# EAGLE schematic controller (EAGLE 9.2.2)

## Sheet 1 of 2
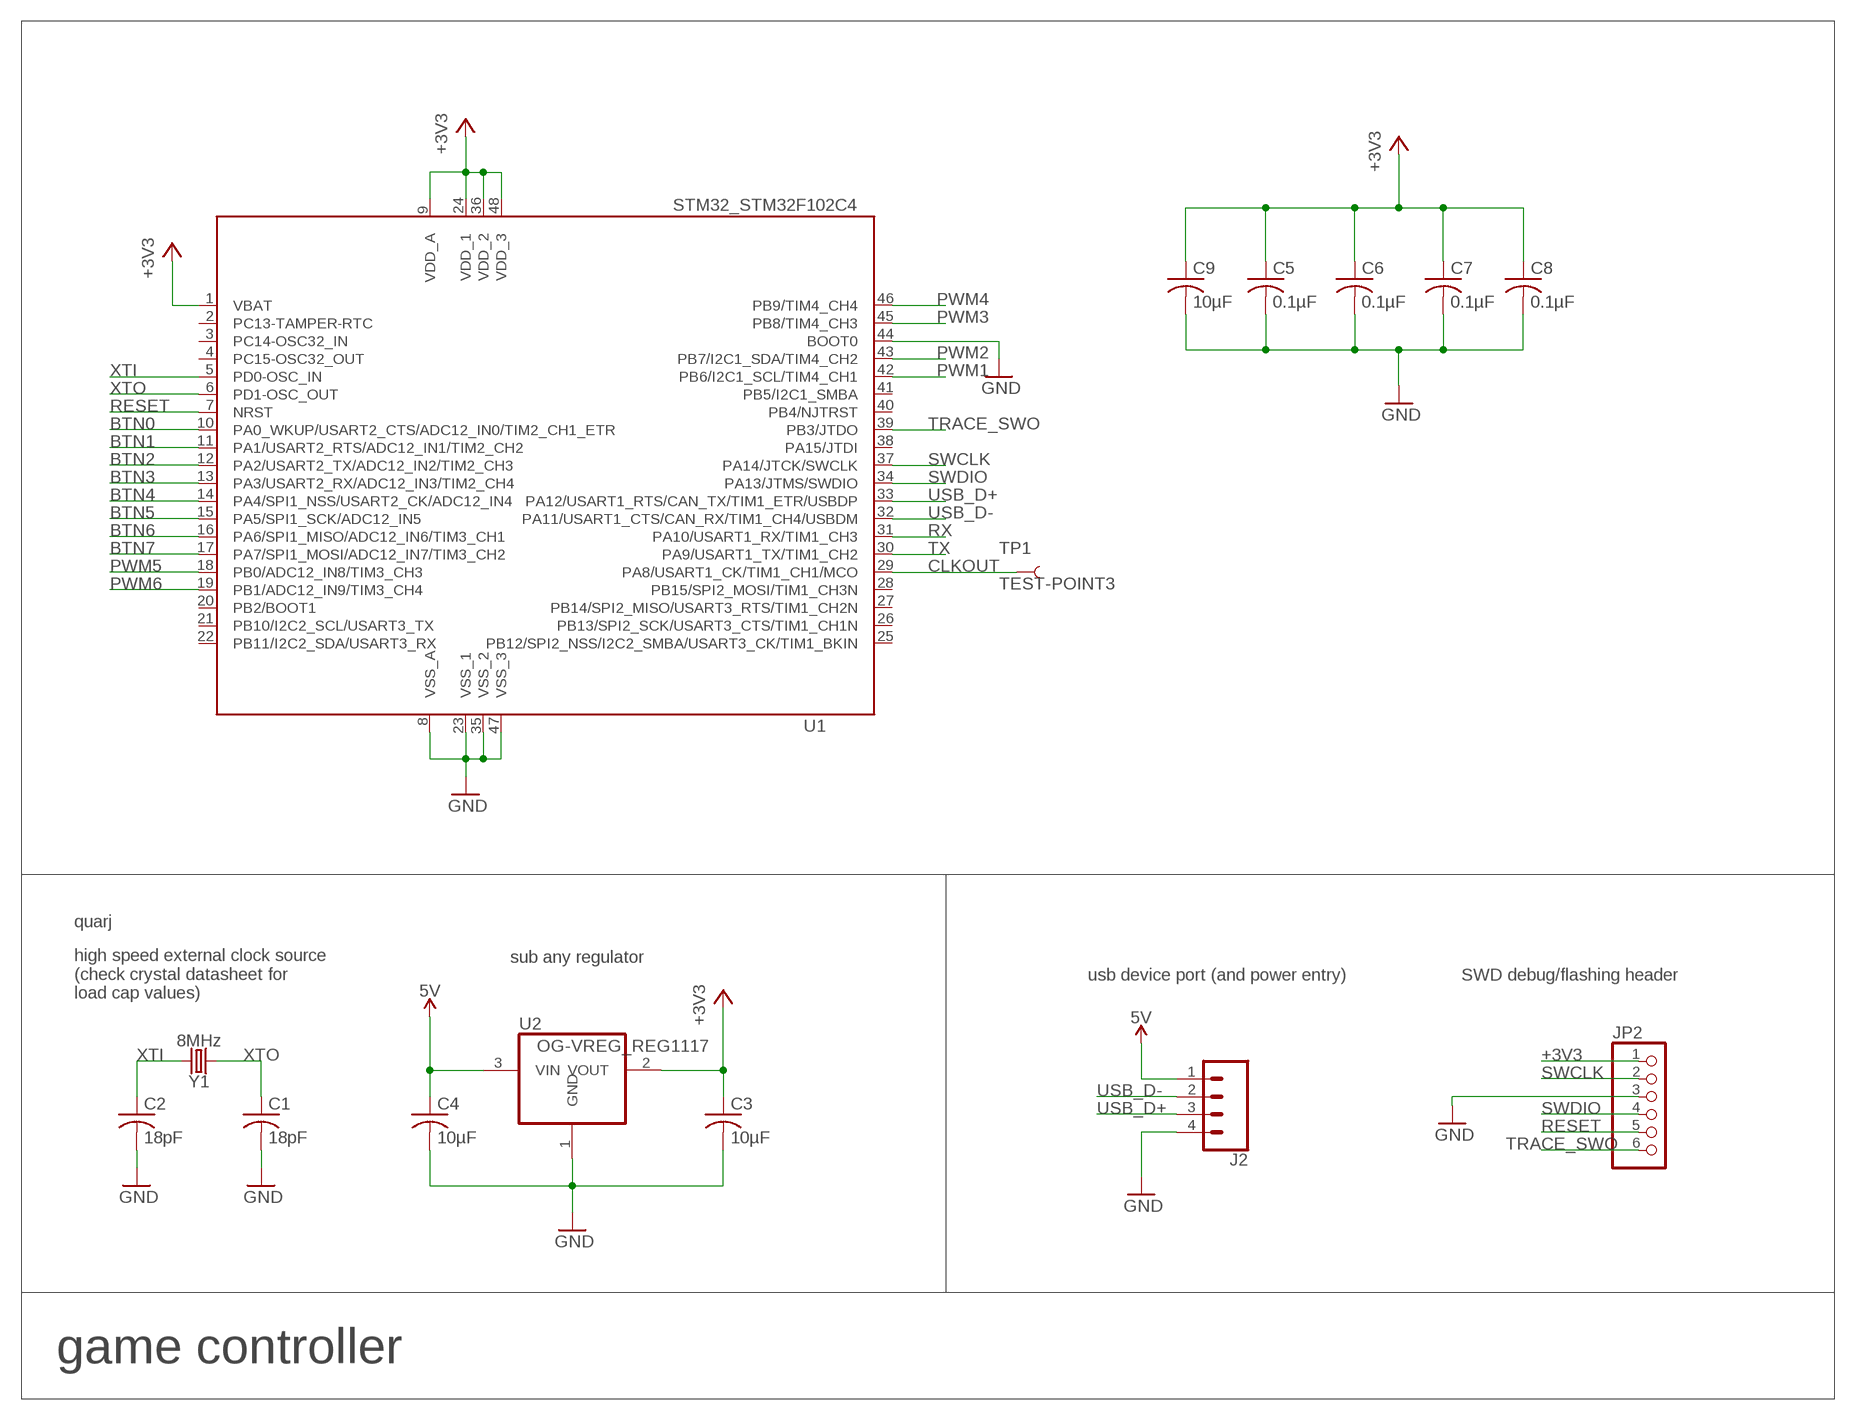
[diagram p0: schematic, sheet 1]

### Parts
C1  18pF  RCL_C-USC0805K  [RCL_C0805K]
C2  18pF  RCL_C-USC0805K  [RCL_C0805K]
C3  10µF  RCL_C-USC0805K  [RCL_C0805K]
C4  10µF  RCL_C-USC0805K  [RCL_C0805K]
C5  0.1µF  RCL_C-USC0805K  [RCL_C0805K]
C6  0.1µF  RCL_C-USC0805K  [RCL_C0805K]
C7  0.1µF  RCL_C-USC0805K  [RCL_C0805K]
C8  0.1µF  RCL_C-USC0805K  [RCL_C0805K]
C9  10µF  RCL_C-USC0805K  [RCL_C0805K]
J2  CONN_04  [1X04]
JP2  PINHD-1X6  [1X06]
TP1  TEST-POINT3  [PAD.03X.03]
U1  STM32_STM32F102C4  [STM32_LQFP48]
U2  OG-VREG_REG1117  [OG-VREG_SOT223]
Y1  8MHz  CRYSTAL-8MHZSMD-HC49UP  [HC49UP]

### Nets
5V: C4.1 J2.1 U2.3(VIN)
+3V3: C3.1 C5.1 C6.1 C7.1 C8.1 C9.1 JP2.1 U1.1(VBAT) U1.9(VDD_A) U1.24(VDD_1) U1.36(VDD_2) U1.48(VDD_3) U2.2(VOUT) ; also sheet 2
BTN0: U1.10(PA0_WKUP/USART2_CTS/ADC12_IN0/TIM2_CH1_ETR)
BTN1: U1.11(PA1/USART2_RTS/ADC12_IN1/TIM2_CH2) ; also sheet 2
BTN2: U1.12(PA2/USART2_TX/ADC12_IN2/TIM2_CH3) ; also sheet 2
BTN3: U1.13(PA3/USART2_RX/ADC12_IN3/TIM2_CH4)
BTN4: U1.14(PA4/SPI1_NSS/USART2_CK/ADC12_IN4)
BTN5: U1.15(PA5/SPI1_SCK/ADC12_IN5)
BTN6: U1.16(PA6/SPI1_MISO/ADC12_IN6/TIM3_CH1)
BTN7: U1.17(PA7/SPI1_MOSI/ADC12_IN7/TIM3_CH2)
CLKOUT: TP1.P$1 U1.29(PA8/USART1_CK/TIM1_CH1/MCO)
GND: C1.2 C2.2 C3.2 C4.2 C5.2 C6.2 C7.2 C8.2 C9.2 J2.4 JP2.3 U1.8(VSS_A) U1.23(VSS_1) U1.35(VSS_2) U1.44(BOOT0) U1.47(VSS_3) U2.1(GND) ; also sheet 2
PWM1: U1.42(PB6/I2C1_SCL/TIM4_CH1) ; also sheet 2
PWM2: U1.43(PB7/I2C1_SDA/TIM4_CH2) ; also sheet 2
PWM3: U1.45(PB8/TIM4_CH3) ; also sheet 2
PWM4: U1.46(PB9/TIM4_CH4) ; also sheet 2
PWM5: U1.18(PB0/ADC12_IN8/TIM3_CH3) ; also sheet 2
PWM6: U1.19(PB1/ADC12_IN9/TIM3_CH4) ; also sheet 2
RESET: JP2.5 U1.7(NRST)
RX: U1.31(PA10/USART1_RX/TIM1_CH3)
SWCLK: JP2.2 U1.37(PA14/JTCK/SWCLK)
SWDIO: JP2.4 U1.34(PA13/JTMS/SWDIO)
TRACE_SWO: JP2.6 U1.39(PB3/JTDO)
TX: U1.30(PA9/USART1_TX/TIM1_CH2)
USB_D+: J2.3 U1.33(PA12/USART1_RTS/CAN_TX/TIM1_ETR/USBDP)
USB_D-: J2.2 U1.32(PA11/USART1_CTS/CAN_RX/TIM1_CH4/USBDM)
XTI: C2.1 U1.5(PD0-OSC_IN) Y1.2
XTO: C1.1 U1.6(PD1-OSC_OUT) Y1.1
Unconnected: U1.2(PC13-TAMPER-RTC) U1.3(PC14-OSC32_IN) U1.4(PC15-OSC32_OUT) U1.20(PB2/BOOT1) U1.21(PB10/I2C2_SCL/USART3_TX) U1.22(PB11/I2C2_SDA/USART3_RX) U1.25(PB12/SPI2_NSS/I2C2_SMBA/USART3_CK/TIM1_BKIN) U1.26(PB13/SPI2_SCK/USART3_CTS/TIM1_CH1N) U1.27(PB14/SPI2_MISO/USART3_RTS/TIM1_CH2N) U1.28(PB15/SPI2_MOSI/TIM1_CH3N) U1.38(PA15/JTDI) U1.40(PB4/NJTRST) U1.41(PB5/I2C1_SMBA)

### Notes on the sheet
- quarj
- sub any regulator
- usb device port (and power entry) | SWD debug/flashing header
- high speed external clock source
  (check crystal datasheet for 
  load cap values)
- game controller

## Sheet 2 of 2
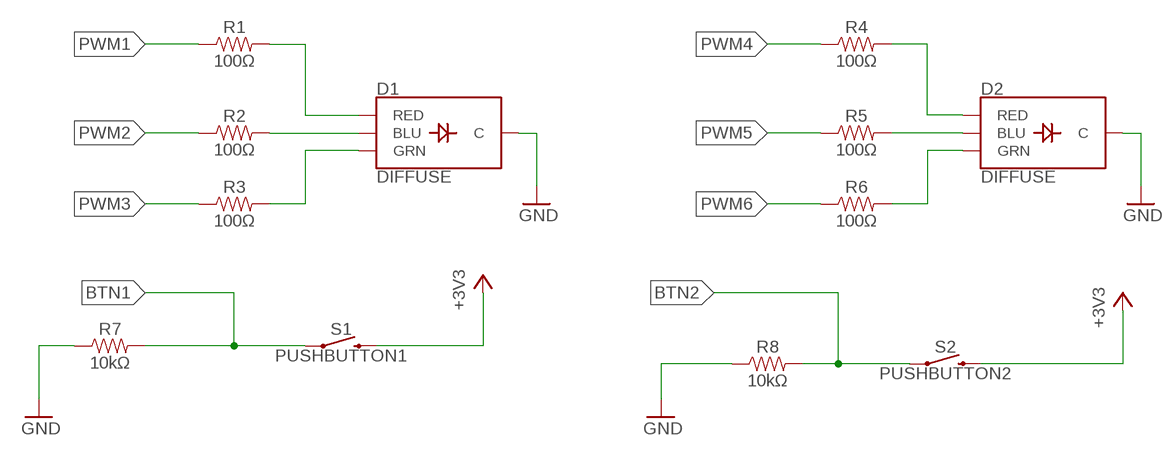
[diagram p1: schematic, sheet 2]

### Parts
D1  DIFFUSE  LED-RGB-CCDIFFUSE  [LED-RGB-THRU]
D2  DIFFUSE  LED-RGB-CCDIFFUSE  [LED-RGB-THRU]
R1  100Ω  0.3OHM-0805-1/8W-1%  [0805]
R2  100Ω  0.3OHM-0805-1/8W-1%  [0805]
R3  100Ω  0.3OHM-0805-1/8W-1%  [0805]
R4  100Ω  0.3OHM-0805-1/8W-1%  [0805]
R5  100Ω  0.3OHM-0805-1/8W-1%  [0805]
R6  100Ω  0.3OHM-0805-1/8W-1%  [0805]
R7  10kΩ  0.3OHM-0805-1/8W-1%  [0805]
R8  10kΩ  0.3OHM-0805-1/8W-1%  [0805]
S1  PUSHBUTTON1  MOMENTARY-SWITCH-SPST-PTH-6.0MM  [TACTILE_SWITCH_PTH_6.0MM]
S2  PUSHBUTTON2  MOMENTARY-SWITCH-SPST-PTH-6.0MM  [TACTILE_SWITCH_PTH_6.0MM]

### Nets
+3V3: S1.3 S2.3 ; also sheet 1
BTN1: R7.2 S1.1 ; also sheet 1
BTN2: R8.2 S2.1 ; also sheet 1
GND: D1.2(C) D2.2(C) R7.1 R8.1 ; also sheet 1
N$1: D1.1(RED) R1.2
N$2: D1.4(BLU) R2.2
N$3: D1.3(GRN) R3.2
N$4: D2.4(BLU) R5.2
N$5: D2.1(RED) R4.2
N$6: D2.3(GRN) R6.2
PWM1: R1.1 ; also sheet 1
PWM2: R2.1 ; also sheet 1
PWM3: R3.1 ; also sheet 1
PWM4: R4.1 ; also sheet 1
PWM5: R5.1 ; also sheet 1
PWM6: R6.1 ; also sheet 1

## Library data of the parts
C1-C9 = braids_v50:RCL_C-US: CAPACITOR, American symbol
D1 D2 = SparkFun-LED:LED-RGB-CC: LED-RGB Common Cathode Packages: LED RGB-THRU LED_PIRANHA_5MM SparkFun Products: RGB Diffused Common Cathode- Diffuse <[https://www.sparkfun.com/products/9264]> RGB Diffused Common Cathode - Clear <[https://www.sparkfun.com/products/105]> LED-RGB 5mm Square (Piranha) <[https://www.sparkfun.com/products/11679]>; PROD_ID: DIO-09434
J2 = SparkFun-Connectors:CONN_04: Multi connection point. Often used as Generic Header-pin footprint for 0.1 inch spaced/style header connections On any of the 0.1 inch spaced packages, you can populate with these: Break Away Headers - Straight <https://www.sparkfun.com/products/116> (PRT-00116) Break Away Male Headers - Right Angle <https://www.sparkfun.com/products/553> (PRT-00553) Female Headers <https://www.sparkfun.com/products/115> (PRT-00115) Break Away Headers - Machine Pin <https://www.sparkfun.com/products/117> (PRT-00117) Break Away Female Headers - Swiss Machine Pin <https://www.sparkfun.com/products/743> (PRT-00743) For SCREWTERMINALS and SPRING TERMINALS visit here: Screw Terimnals on SparkFun.com <https://www.sparkfun.com/search/results?term=Screw+Terminals> (5mm/3.5mm/2.54mm spacing) This device is also useful as a general connection point to wire up your design to another part of your project. Our various solder wires solder well into these plated through hole pads. Hook-Up Wire - Assortment (Stranded, 22 AWG) <https://www.sparkfun.com/products/11375> (PRT-11375) Hook-Up Wire - Assortment (Solid Core, 22 AWG) <https://www.sparkfun.com/products/11367> (PRT-11367) View the entire wire category on our website here <https://www.sparkfun.com/categories/141> Special notes: Molex polarized connector foot print use with SKU : PRT-08231 with associated crimp pins and housings. 1MM SMD Version SKU: PRT-10208; PROD_ID: CONN-09696
JP2 = pinhead:PINHD-1X6: PIN HEADER
R1-R8 = SparkFun-Resistors:0.3OHM: 0.3Ω resistor A resistor is a passive two-terminal electrical component that implements electrical resistance as a circuit element. Resistors act to reduce current flow, and, at the same time, act to lower voltage levels within circuits. - Wikipedia; PROD_ID: RES-11622; VALUE: 0.3
S1 S2 = SparkFun-Switches:MOMENTARY-SWITCH-SPST: Momentary Switch (Pushbutton) - SPST Normally-open (NO) SPST momentary switches (buttons, pushbuttons). Variants PTH-12MM - 12mm square, through-hole Momentary Pushbutton Switch - 12mm Square <https://www.sparkfun.com/products/9190> (COM-09190) PTH-6.0MM, PTH-6.0MM-KIT - 6.0mm square, through-hole Mini Pushbutton Switch <https://www.sparkfun.com/products/97> (COM-00097) KIT package intended for soldering kit's - only one side of pads' copper is exposed. PTH-RIGHT-ANGLE-KIT - Right-angle, through-hole Right Angle Tactile Button <https://www.sparkfun.com/products/10791> - Used on SparkFun BigTime Watch Kit <https://www.sparkfun.com/products/11734> SMD-12MM - 12mm square, surface-mount Tactile Button - SMD (12mm) <https://www.sparkfun.com/products/12993> (COM-12993) Used on SparkFun PicoBoard <https://www.sparkfun.com/products/11888> SMD-4.5MM - 4.5mm Square Trackball Switch Used on SparkFun Blackberry Trackballer Breakout <https://www.sparkfun.com/products/13169> SMD-4.6MMX2.8MM - 4.60mm x 2.80mm, surface mount Used on SparkFun SAMD21 Mini Breakout <https://www.sparkfun.com/products/13664> SMD-5.2MM, SMD-5.2-REDUNDANT - 5.2mm square, surface-mount Mini Pushbutton Switch - SMD <https://www.sparkfun.com/products/8720> (COM-08720) Used on Arduino Pro Mini <https://www.sparkfun.com/products/11114> REDUNDANT package connects both switch circuits together SMD-6.0X3.5MM - 6.0 x 3.5mm, surface mount Momentary Reset Switch SMD <https://www.sparkfun.com/products/8229> (COM-08229) SMD-6.2MM-TALL - 6.2mm square, surface mount Tactile Button - SMD (6mm) <https://www.sparkfun.com/products/12992> Used on SparkFun Digital Sandbox <https://www.sparkfun.com/products/12651> SMD-RIGHT-ANGLE - Right-angle, surface mount Used on SparkFun Block for Intel® Edison - Arduino <https://www.sparkfun.com/products/13036>; PROD_ID: SWCH-08441; SF_SKU: COM-00097
TP1 = SparkFun-Connectors:TEST-POINT: SparkFun Test Points Bare copper test points for troubleshooting or In-Circuit-Testing. These are used by our Production team for verifying production board runs using pogo-pins on test beds. SparkFun Products: SparkFun LSM9DS1 Breakout <https://www.sparkfun.com/products/13284> SparkFun PSOC <https://www.sparkfun.com/products/13714> SparkFun Load Cell Amplifier <https://www.sparkfun.com/products/13879>
U1 = braids_v50:STM32_STM32F102C4
U2 = braids_v50:OG-VREG_REG1117: 800mA and 1A Low Dropout (LDO) Positive Regulator 1.8V, 2.5V, 2.85V, 3.3V, 5V, and Adj
Y1 = SparkFun-Clocks:CRYSTAL-8MHZ: 8MHz Crystal Datasheet Example <http://www.futureelectronics.com/en/technologies/electromechanical/timing-devices/crystals/Pages/6008189-ABM3B-8.000MHZ-B2-T.aspx?IM=0> Frequency: 8MHz Frequency Tolerance: ±20ppm Load Capacitance: 18pF SparkFun Products: Pro Micro -3.3V/8MHz <https://www.sparkfun.com/products/12587> WAV Trigger <https://www.sparkfun.com/products/13660>; PROD_ID: XTAL-11706